# EAGLE design FaceBoard v2 (EAGLE 5.11)
MAN_PART_NO: FDME410NZT; PRICE_1: 0.51000; PRICE_50: 0.42000; URL: http://www.mouser.com/ProductDetail/Fairchild-Semiconductor/FDME410NZT/?qs=NOGltPIuHgd3kJVgng1KwA%3d%3d; VENDOR: Mouser
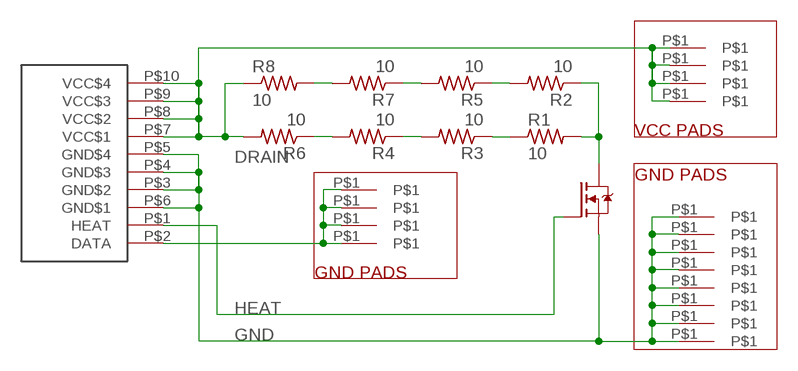
[diagram p0: schematic, sheet 1]

## Parts
K1  FB_FCC_SOLDER_PADS  [FB_FCC_SOLDER_PADS]
R1  10  RESISTOR-2512  [R2512]
R2  10  RESISTOR-2512  [R2512]
R3  10  RESISTOR-2512  [R2512]
R4  10  RESISTOR-2512  [R2512]
R5  10  RESISTOR-2512  [R2512]
R6  10  RESISTOR-2512  [R2512]
R7  10  RESISTOR-2512  [R2512]
R8  10  RESISTOR-2512  [R2512]
U1  SINGLE-NFETMICROFET  [MICROFET]
U$16  12OCLOCK_PAD  [12OCLOCK_PAD]
U$17  12OCLOCK_PAD  [12OCLOCK_PAD]
U$18  12OCLOCK_PAD  [12OCLOCK_PAD]
U$19  12OCLOCK_PAD  [12OCLOCK_PAD]
U$20  LARGE_PAD  [LARGE_PAD]
U$21  LARGE_PAD  [LARGE_PAD]
U$22  LARGE_PAD  [LARGE_PAD]
U$23  LARGE_PAD  [LARGE_PAD]
U$24  SMALL_PAD  [SMALL_PAD]
U$25  SMALL_PAD  [SMALL_PAD]
U$26  SMALL_PAD  [SMALL_PAD]
U$27  SMALL_PAD  [SMALL_PAD]
U$28  SMALL_PAD  [SMALL_PAD]
U$29  SMALL_PAD  [SMALL_PAD]
U$30  SMALL_PAD  [SMALL_PAD]
U$31  SMALL_PAD  [SMALL_PAD]

## Nets
DATA: K1.P$2(DATA) U$16.P$1 U$17.P$1 U$18.P$1 U$19.P$1
DRAIN: R1.P$2 R2.P$1 U1.D
GND: K1.P$3(GND$2) K1.P$4(GND$3) K1.P$5(GND$4) K1.P$6(GND$1) U1.P$2(S) U$24.P$1 U$25.P$1 U$26.P$1 U$27.P$1 U$28.P$1 U$29.P$1 U$30.P$1 U$31.P$1
HEAT: K1.P$1(HEAT) U1.G
N$3: R3.P$2 R4.P$1
N$5: R2.P$2 R5.P$1
N$6: R4.P$2 R6.P$1
N$7: R5.P$2 R7.P$1
N$12: R7.P$2 R8.P$2
N$13: R1.P$1 R3.P$1
VCC: K1.P$7(VCC$1) K1.P$8(VCC$2) K1.P$9(VCC$3) K1.P$10(VCC$4) R6.P$2 R8.P$1 U$20.P$1 U$21.P$1 U$22.P$1 U$23.P$1

## Notes on the sheet
- VCC PADS
- GND PADS
- GND PADS

## Library data of the parts
K1 = Connectors:FB_FCC_SOLDER_PADS
R1-R8 = Passives:RESISTOR: Resistor; MANUFACTURER: Bourns; MAN_PART_NO: CRM2512-FX-10R0ELF; PRICE_1: 0.54000; PRICE_50: 0.43000; URL: http://www.mouser.com/ProductDetail/Bourns/CRM2512-FX-10R0ELF/?qs=9fn1gpisni6tnQBkFqEp6QxwcoajncKGFVU2iojkLDQ%3d; VENDOR: Mouser
U1 = Transistors:SINGLE-NFET
U$16-U$19 = SurfacePads v2:12OCLOCK_PAD
U$20-U$23 = SurfacePads v2:LARGE_PAD
U$24-U$31 = SurfacePads v2:SMALL_PAD

## Board
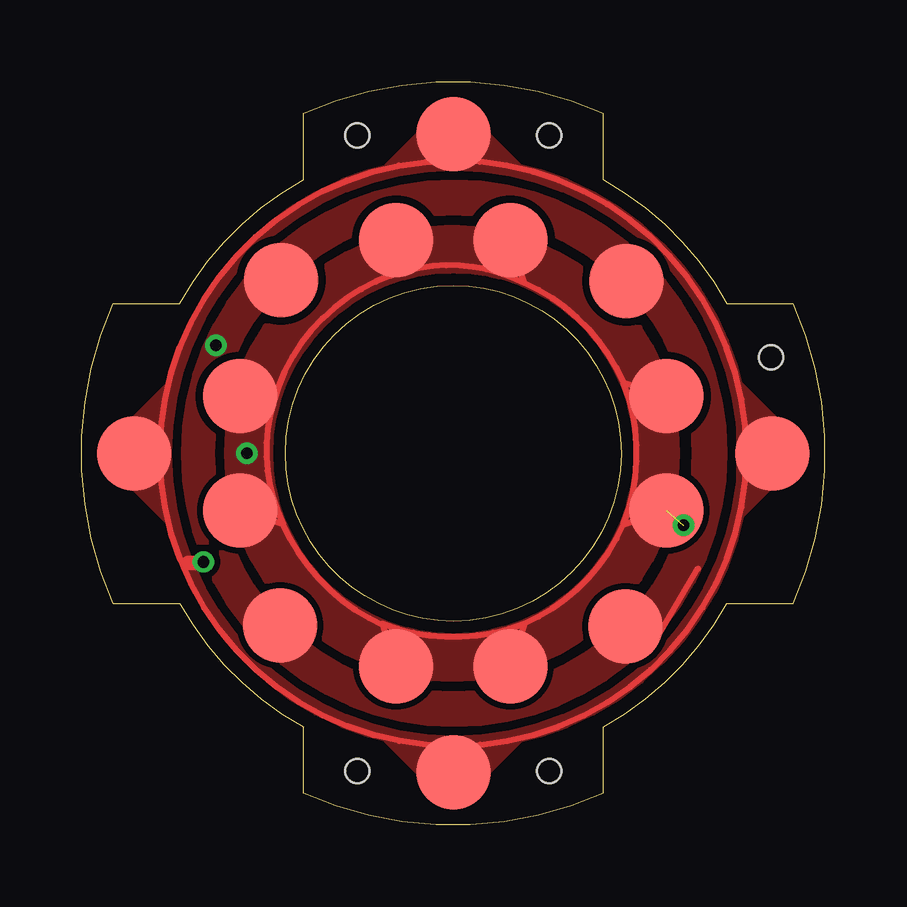
[diagram p1: board, top side]
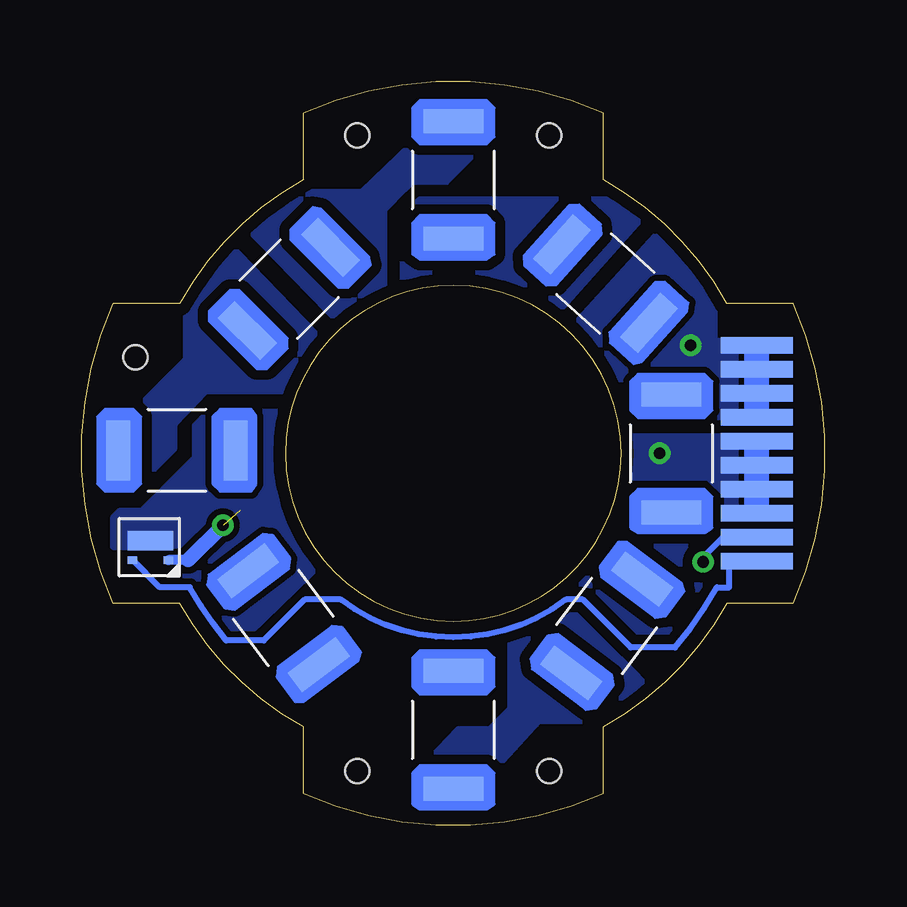
[diagram p2: board, bottom side, seen from below]

Size 30.97 x 30.97 mm. Coordinates in mm from the lower left corner, seen from the top.
Outline: 22.48,15.48 arc-90 15.48,8.48 arc-90 8.48,15.48 arc-90 15.48,22.48 arc-90 22.48,15.48
Outline: 29.67,9.23 arc48 29.67,21.73 26.88,21.73 arc32 21.73,26.88 21.73,29.67 arc48 9.23,29.67 9.23,26.88 arc32 4.08,21.73 1.3,21.73 arc48 1.3,9.23 4.08,9.23 arc32 9.23,4.08 9.23,1.3 arc48 21.73,1.3 21.73,4.08 arc32 26.88,9.23 29.67,9.23
Copper layers (1*16): Top 0.0178mm / dielectric 1.4986mm / Bottom 0.0178mm
Design rules "face board": minimum track width 6mil, minimum drill 14mil, track to track 10mil, track to pad 10mil, pad to pad 10mil, via to via 10mil, smd to smd 0mil, copper to edge 20mil, drill to drill 16mil, minimum pad ring 8mil, minimum via ring 8mil, stop-mask expansion 3mil, vias tented up to drill 0mil, thermal gap 10mil
Holes 1 mm at 11.48,28.73 19.48,28.73 11.48,2.23 19.48,2.23 28.73,19.48

### Footprints (pad centres in the part's own frame; a part is rotated, then mirrored left to right if it is on the bottom)
FB_FCC_SOLDER_PADS = smd 3 x 0.7: P$1 0,4.5; P$2 0,3.5; P$3 0,2.5; P$4 0,1.5; P$5 0,0.5; P$6 0,-0.5; P$7 0,-1.5; P$8 0,-2.5; P$9 0,-3.5; P$10 0,-4.5
R2512 = smd 1 x 2.5: P$1 -2.45,0; P$2 2.45,0
MICROFET = smd 0.8 x 1.9: D -0.27,0 | smd 0.3 x 0.4: G 0.54,-0.75; P$2 0.54,0.75
12OCLOCK_PAD = smd 3.1 x 3.1: P$1 -13.3,0
LARGE_PAD = smd 3.1 x 3.1: P$1 -10.185,0.03
SMALL_PAD = smd 3.1 x 3.1: P$1 0,-9.2

### Placement (x,y rotation side)
K1  2.84,15.48 180 bottom
R1  27.01,15.61 0 bottom
R2  22.56,8.63 307 bottom
R3  22.33,22.33 45 bottom
R4  15.48,26.88 270 bottom
R5  15.48,3.96 270 bottom
R6  9.14,22.56 318 bottom
R7  9.09,8.28 53 bottom
R8  6.4,15.48 270 bottom
U1  28.11,11.57 270 bottom
U$16  15.48,15.48 0 top
U$17  15.48,15.48 270 top
U$18  15.48,15.48 180 top
U$19  15.48,15.48 90 top
U$20  15.48,15.48 45 top
U$21  15.48,15.48 315 top
U$22  15.48,15.48 135 top
U$23  15.48,15.48 225 top
U$24  15.48,15.48 285 top
U$25  15.48,15.48 15 top
U$26  15.48,15.48 195 top
U$27  15.48,15.48 105 top
U$28  15.48,15.48 345 top
U$29  15.48,15.48 255 top
U$30  15.48,15.48 165 top
U$31  15.48,15.48 75 top

### Tracks (layer width: path | path; a pad name or v marks a point on that pad's centre or on a via)
DATA  (via drill 0.48)
  Top 0.254: 1.76,15.48 U$16.P$1 3.26,15.48 | 3.26,15.48 arc-90 15.46,27.68 | 15.48,29.19 U$17.P$1 15.46,27.68 | 27.71,15.48 arc90 15.46,27.68 | 29.45,15.48 U$18.P$1 27.71,15.48 | 15.48,3.28 arc90 27.71,15.48 | 15.08,1.78 U$19.P$1 15.48,3.28 | 15.48,3.28 arc-90 3.26,15.48
  Top 0.61: v5.06,10.96 5.01,10.91 4.43,10.91
  Bottom 0.254: 1.76,11.98 K1.P$2 4.24,11.98 5.06,11.16 v5.06,10.96
  pour Top (isolate 0.305, no thermals): 3.63,15.48 arc-180 27.43,15.48 27.78,15.48 arc180 3.28,15.48
  pour Top (no thermals): 27.43,15.48 arc-180 3.63,15.48 3.28,15.48 arc180 27.78,15.48
  pour Top (no thermals): 2.14,16.87 3.54,18.27 3.54,12.68 2.14,14.08
  pour Top (no thermals): 28.81,14.21 27.42,12.81 27.42,18.4 28.81,17
  pour Top (no thermals): 16.87,28.81 18.27,27.42 12.68,27.42 14.08,28.81
  pour Top (no thermals): 14.08,2.14 12.68,3.54 18.27,3.54 16.87,2.14
DRAIN
  Bottom 0.61: R2.P$1 24.43,10.73
  pour Bottom (isolate 0.254, no thermals): 20.8,11.04 22.41,14.31 22.16,17.23 25.71,17.21 26.27,16.62 26.27,15.29 28.48,13.08 29.38,13.08 29.68,12.78 29.68,11.58 27.18,11.58 26.48,9.88 26.27,9.38 arc-10 24.62,7.35
GND  (via drill 0.48)  (1 unrouted)
  Top 0.254: 7.98,17.64 arc42 8.38,12.52 | 7.98,17.64 U$29.P$1 | 13.52,23.08 U$26.P$1 | 13.52,23.08 arc60 7.98,17.64 | 18.44,22.58 arc42 13.52,23.08 | 18.44,22.58 U$30.P$1 | 22.58,18.44 arc42 18.44,22.58 | 22.58,18.44 U$27.P$1 | 22.58,12.52 arc42 22.58,18.44 | 22.58,12.52 U$31.P$1 24.53,11.68 | 18.44,8.38 arc42 22.58,12.52 | 18.44,8.38 U$25.P$1 | 18.44,8.38 arc-42 12.52,8.38 U$28.P$1 | 8.38,12.52 arc42 12.58,8.31 | 8.38,12.52 U$24.P$1
  Bottom 0.127: K1.P$5 K1.P$6
  Bottom 0.406: 26.54,11.03 U1.P$2
  Bottom 0.61: K1.P$5 2.88,14.98 | v25.08,12.48 26.54,11.03 | K1.P$4 K1.P$3
  other vias: 6.88,15.48
  pour Top (isolate 0.305, no thermals): 7.68,15.48 24.83,15.48 arc180 6.03,15.48
  pour Top (no thermals): 23.18,15.48 6.03,15.48 arc180 24.83,15.48
  pour Bottom (no thermals): 3.48,16.18 9.88,16.18 9.88,14.48 4.88,14.48 4.08,13.68 4.08,12.98 3.48,12.98
HEAT
  Bottom 0.254: U1.G 27.72,9.9 26.47,9.9 arc-10 24.95,7.68 23.38,7.68 21.68,9.38 20.18,9.38 arc-74 10.78,9.38 10.08,9.38 8.08,7.38 6.24,7.38 arc-10 4.49,9.9 3.98,9.9 3.98,10.98 K1.P$1
N$3
  pour Bottom (isolate 0.406): 13.91,28.66 15.78,26.78 17.21,26.78 17.51,26.48 18.37,25.61 18.37,21.8 19.96,20.59 24.29,25.07 22.57,26.4 19.3,26.39 17.24,28.36 17.24,29.72 16.88,30.08
N$5
  pour Bottom (isolate 0.406, no thermals): 13.8,8.07 16.85,7.88 20.77,9.44 24.29,5.91 arc-20 22.82,4.81 14.58,4.78 14.3,4.78 13.77,5.31
N$6
  Bottom 0.406: R6.P$1 10.91,24.11
  pour Bottom (isolate 0.406): 11.43,21.03 7.16,25.8 7.54,26.07 16.88,26.07 17.59,25.35 17.59,21.97 arc55
N$7
  Bottom 0.254: R5.P$2 15.31,1.63
  Bottom 0.61: R5.P$2 15.48,1.63
  pour Bottom (isolate 0.406): 14.17,0.75 13.87,2.17 11.92,4.33 9.02,4.33 7.16,5.53 10.75,9.18 13.12,8.08 13.12,4.84 13.97,3.98 15.28,3.98 17.12,2.05 16.82,0.77
N$12
  Bottom 0.61: R8.P$2 6.4,12.98
  pour Bottom (isolate 0.406, no thermals): 10.89,10.44 7.92,7.44 6.18,7.48 5.06,9 4.78,9.58 4.78,13.61 5.06,13.89 7.48,13.88 7.66,13.88 8.16,13.49 arc25 8.97,13.43 arc30
N$13
  Bottom 0.254: R1.P$1 29.34,15.4
  Bottom 0.61: R1.P$1 29.18,15.48
  pour Bottom (isolate 0.406): 26.65,21.97 26.65,19.39 28.78,17.26 29.88,17.24 arc-20 30.08,14.19 28.78,13.98 27.11,15.69 27.11,16.7 25.78,18.07 21.84,18.07 20.69,19.91 24.97,24.38
VCC  (via drill 0.48)
  Top 0.254: U$21.P$1 7.39,23.58 | U$23.P$1 23.58,23.58 | U$22.P$1 23.68,7.28 25.68,10.68 | 7.38,7.28 U$20.P$1
  Top 0.305: U$23.P$1 23.16,23.16
  Bottom 0.254: K1.P$10 2.84,19.85
  other vias: 5.58,19.98
  pour Bottom (no thermals): 10.67,20.62 6.42,25.29 arc20 4.61,23.39 4.61,20.18 3.48,20.18 3.48,16.98 8.57,16.98
  pour Top (isolate 0.305, no thermals): 25.53,15.48 26.81,15.48 arc180 4.23,15.48 5.43,15.48 arc-180
  pour Top (no thermals): 5.43,15.48 4.23,15.48 arc180 26.81,15.48 25.53,15.48 arc-180